# Altium schematic sheet Valve.SchDoc
size A4; SheetNumber: 6; SheetTotal: 7
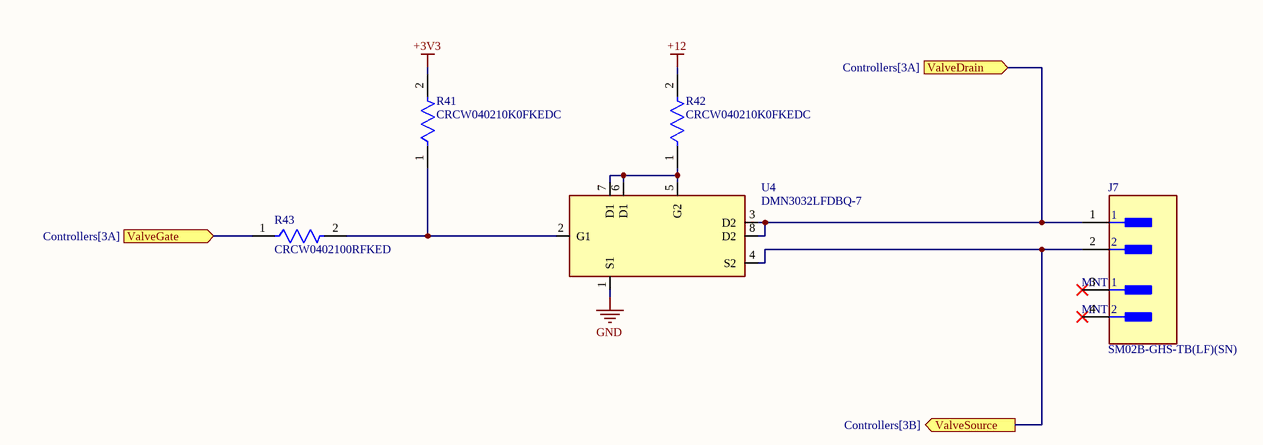
[diagram p0: Valve.SchDoc]

## Parts
J7  SM02B-GHS-TB(LF)(SN)  [FP-SM02B-GHS-TB_LF_SN-MFG]
R41  CRCW040210K0FKEDC  [FP-CRCW0402-C-e3-IPC_C]
R42  CRCW040210K0FKEDC  [FP-CRCW0402-C-e3-IPC_C]
R43  CRCW0402100RFKED  [FP-CRCW0402-e3-IPC_C]
U4  DMN3032LFDBQ-7  [DMN3032LFDBQ-13]

## Ports
ValveDrain (in, see Controllers[3A]), ValveGate (in, see Controllers[3A]), ValveSource (out, see Controllers[3B])

## Nets
+3V3: R41.2
+12: R42.2
GND: U4.1(S1)
ValveDrain: J7.1 U4.3(D2) U4.8(D2) ; port ValveDrain
ValveGate: R43.1 ; port ValveGate
ValveSource: J7.2 U4.4(S2) ; port ValveSource
NetR41_1: R41.1 R43.2 U4.2(G1)
NetR42_1: R42.1 U4.5(G2) U4.6(D1) U4.7(D1)

Not connected (* = marked no-connect by the designer): J7 3(MNT_1)* 4(MNT_2)*

## Library data of the parts
J7 = CMP-2000-07076-2: CONN HEADER SMD R/A 2POS 1.25MM; Voltage Rating: 50V; Number of Positions: 2; Pitch: 0.049inch; Current Rating: 1A; Connector Type: Outer Shroud Contact; Number of Rows: 1; Contact Material: Bronze; Termination: Solder; Color: Natural; Package Quantity: 2500; Mount: Surface Mount; Housing Color: Natural; Number of Contacts: 2; Packaging: Tape and Reel; Lead Free: Lead Free; Housing Material: Nylon; Orientation: Right Angle; Contact Type: Male Pin; Contact Plating: Tin; Series: GH; Fastening Type: Latch
R41 R42 = CMP-02407-012085-1: RES 10K OHM 1% 1/16W 0402; Temperature Coefficient: 100ppm/°C; Power Rating: 62.5mW; Resistance: 10kR; Lead Free: Lead Free; Max Operating Temperature: 155°C; RoHS Compliant: Yes; Mount: Surface Mount; Min Operating Temperature: -55°C; Termination: Wraparound; Length: 1mm; Resistor Type: Thick Film; Contact Plating: Tin; Tolerance: 1%; Case/Package: Molded
R43 = CMP-1011-00397-3: RES Thick Film, 100Ω, 1%, 0.063W, 100ppm/°C, 0402; Max Power Dissipation: 63mW; Voltage Rating: 50V; Resistance: 100R; Package Quantity: 10; Lead Free: Lead Free; Termination: SMD/SMT; Case Code (Metric): 1005; Number of Terminations: 2; Composition: Thick Film; Voltage Rating (DC): 50V; Min Operating Temperature: -55°C; Case/Package: 0402; Radiation Hardening: No; Max Operating Temperature: 155°C; Temperature Coefficient: 100ppm/°C; Military Standard: Not; Length: 1mm; Mount: Surface Mount; Power Rating: 63mW; Weight: 2.3E-05oz; Working Voltage: 50V; Features: Automotive AEC-Q200; Depth: 0.5mm; Packaging: Tape and Reel; Tolerance: 1%; Height: 0.35mm; Case Code (Imperial): 0402; Width: 0.02inch; Contact Plating: Tin
U4 = DMN3032LFDBQ: Value: *; Mouser URL: https://www.mouser.pl/ProductDetail/Diodes-Incorporated/DMN3032LFDBQ-13?qs=icAhCOE9Tbh4ep37eQESbg%3D%3D; MPN: *; Supplier: *; SupplierPartNumber: DMN3032LFDBQ-13